# EAGLE design 40khz_ultrasonic_transmitter (EAGLE 6.5.0)
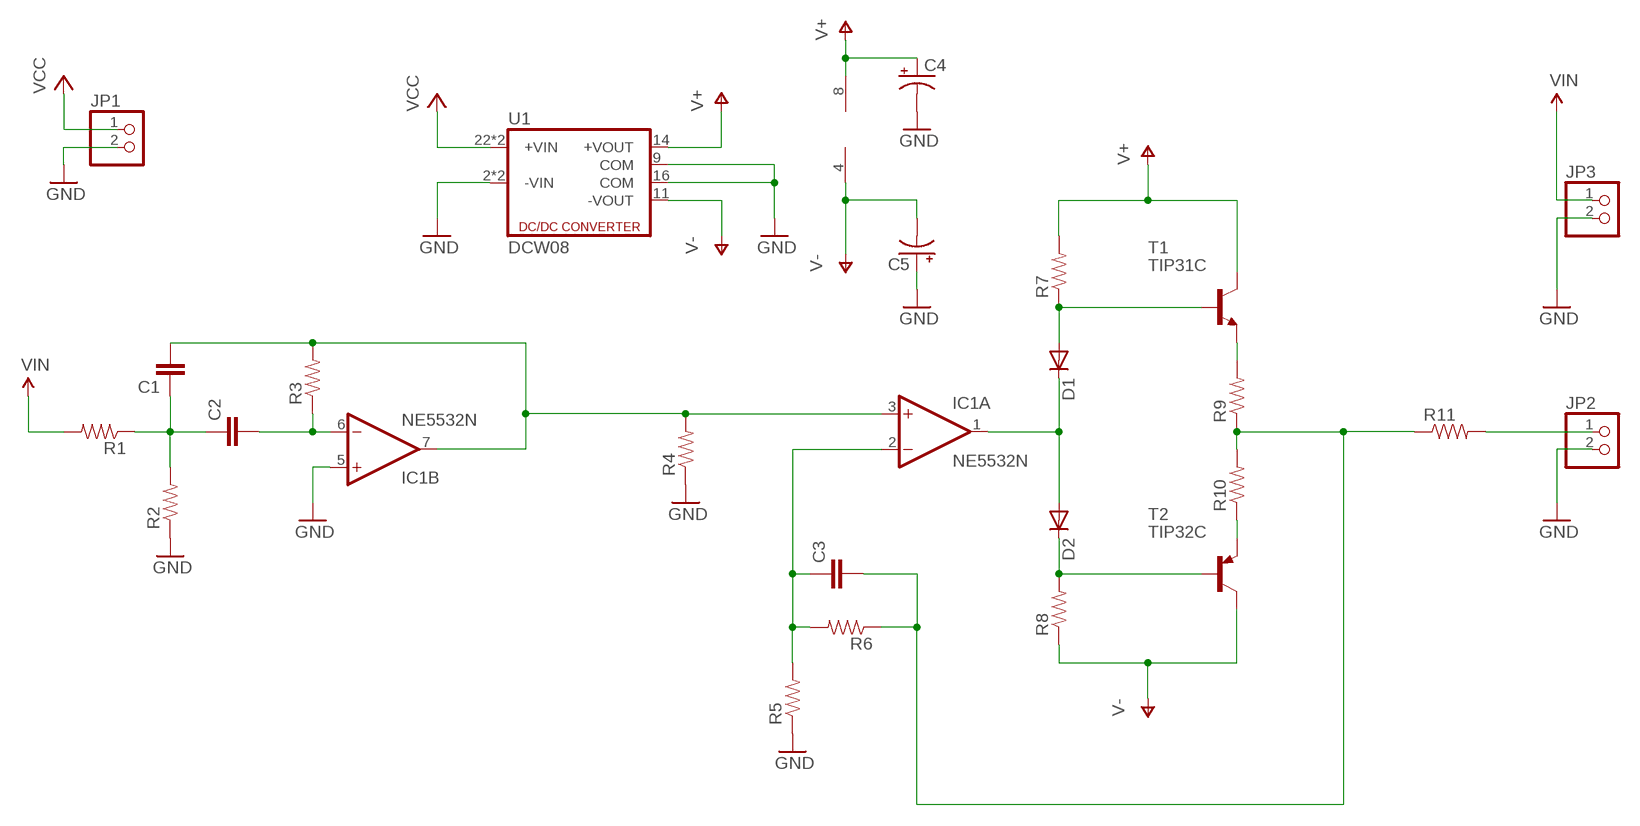
[diagram p0: schematic, sheet 1]

## Parts
C1  CAPPTH2  [CAP-PTH-SMALL2]
C2  CAPPTH2  [CAP-PTH-SMALL2]
C3  CAPPTH2  [CAP-PTH-SMALL2]
C4  CAP_POLPTH1  [CPOL-RADIAL-100UF-25V]
C5  CAP_POLPTH1  [CPOL-RADIAL-100UF-25V]
D1  DIODE1N4148  [DIODE-1N4148]
D2  DIODE1N4148  [DIODE-1N4148]
IC1  NE5532N  [DIL08]
JP1  PINHD-1X2  [1X02]
JP2  PINHD-1X2  [1X02]
JP3  PINHD-1X2  [1X02]
R1  RESISTORPTH-1/4W  [AXIAL-0.4]
R2  RESISTORPTH-1/4W  [AXIAL-0.4]
R3  RESISTORPTH-1/4W  [AXIAL-0.4]
R4  RESISTORPTH-1/4W  [AXIAL-0.4]
R5  RESISTORPTH-1/4W  [AXIAL-0.4]
R6  RESISTORPTH-1/4W  [AXIAL-0.4]
R7  RESISTORPTH-1/4W  [AXIAL-0.4]
R8  RESISTORPTH-1/4W  [AXIAL-0.4]
R9  RESISTORPTH-1/4W  [AXIAL-0.4]
R10  RESISTORPTH-1/4W  [AXIAL-0.4]
R11  RESISTORPTH-2W  [AXIAL-0.8]
T1  TIP31C  [TO220]
T2  TIP32C  [TO220]
U1  DCW08  [DCW08]

## Nets
GND: C4.2(-) C5.1(+) IC1.5(B:+IN) JP1.2 JP2.2 JP3.2 R2.P$1 R4.P$1 R5.P$1 U1.2(-VIN) U1.3(-VIN) U1.9(COM) U1.16(COM)
N$1: C3.2 R6.P$1 R9.P$1 R10.P$2 R11.P$1
N$2: R9.P$2 T1.3(E)
N$3: R10.P$1 T2.3(E)
N$4: D1.A R7.P$1 T1.1(B)
N$5: D2.C R8.P$2 T2.1(B)
N$6: C1.2 IC1.3(A:+IN) IC1.7(B:OUT) R3.P$2 R4.P$2
N$7: C1.1 C2.1 R1.P$1 R2.P$2
N$8: C3.1 IC1.2(A:-IN) R5.P$2 R6.P$2
N$9: C2.2 IC1.6(B:-IN) R3.P$1
N$10: JP2.1 R11.P$2
N$14: D1.C D2.A IC1.1(A:OUT)
V+: C4.1(+) IC1.8(P:V+) R7.P$2 T1.2(C) U1.14(+VOUT)
V-: C5.2(-) IC1.4(P:V-) R8.P$1 T2.2(C) U1.11(-VOUT)
VCC: JP1.1 U1.22(+VIN) U1.23(+VIN)
VIN: JP3.1 R1.P$2

## Library data of the parts
C1-C3 = SparkFun-Passives:CAP: Capacitor Standard 0603 ceramic capacitor, and 0.1" leaded capacitor.
C4 C5 = SparkFun-Passives:CAP_POL: Capacitor Polarized These are standard SMD and PTH capacitors. Normally 10uF, 47uF, and 100uF in electrolytic and tantalum varieties. Always verify the external diameter of the through hole cap, it varies with capacity, voltage, and manufacturer. The EIA devices should be standard.
D1 D2 = SparkFun-DiscreteSemi:DIODE: Diode These are standard reverse protection diodes and small signal diodes. SMA package can handle up to about 1A. SOD-323 can handle about 200mA. What the SOD-323 package when ordering, there are some mfgs out there that are 5-pin packages.
IC1 = linear:NE5532: AUDIO AMPLIFIER
JP1-JP3 = pinhead:PINHD-1X2: PIN HEADER
R1-R11 = SparkFun-Passives:RESISTOR: Resistor Basic schematic elements and footprints for 0603, 1206, and PTH resistors.
T1 = transistor-neu-to92:TIP31C: NPN TRANSISTOR
T2 = transistor:TIP32: PNP Transistor Medium Power Linear Switching Applications Source: http://onsemi.com
U1 = dc-dc-converter:DCW08: DCW08 Isolated DC/DC Converters 8W From: http://www.mouser.com/ds/2/260/DCW08-spec-42779.pdf

## Board
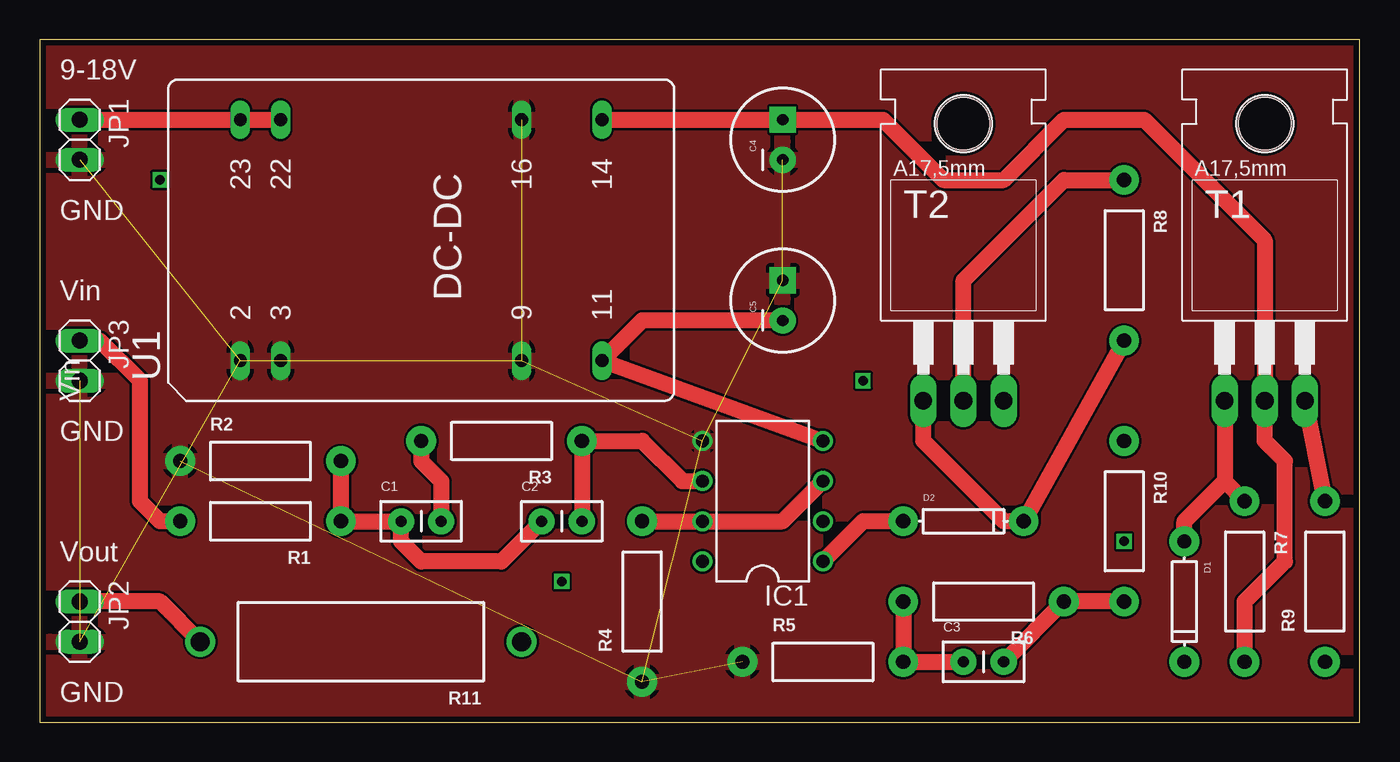
[diagram p1: board, top side]
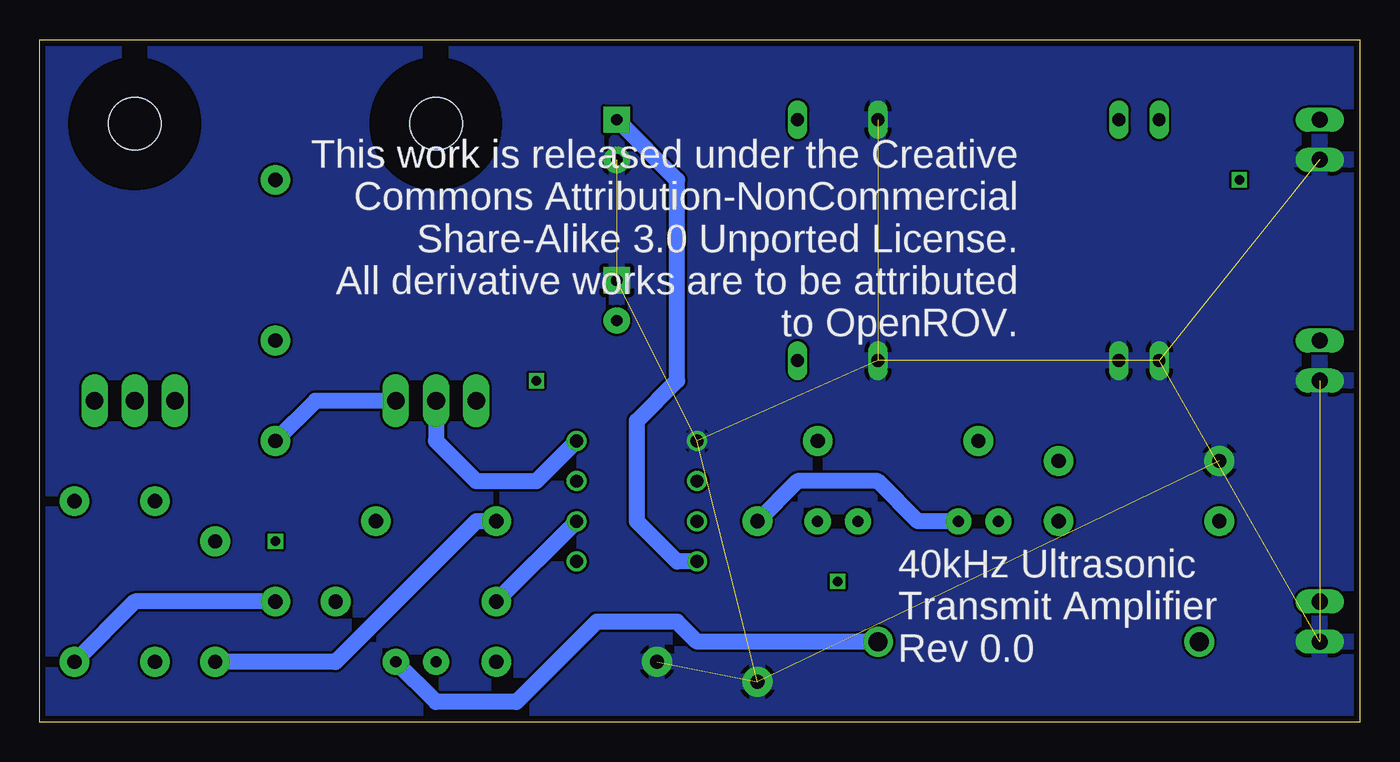
[diagram p2: board, bottom side, seen from below]

Size 83.49 x 43.17 mm. Coordinates in mm from the lower left corner, seen from the top.
Outline: 0,0 83.49,0 83.49,43.17 0,43.17 0,0
Copper layers (1*16): Top 0.0356mm / dielectric 1.5011mm / Bottom 0.0356mm
Design rules "LaenPCBOrder": minimum track width 6mil, minimum drill 13mil, track to track 6mil, track to pad 6mil, pad to pad 6mil, via to via 6mil, smd to smd 6mil, copper to edge 15mil, drill to drill 6mil, minimum pad ring 7mil, minimum via ring 7mil, stop-mask expansion 3mil, vias tented up to drill 0mil, thermal gap 10mil

### Footprints (pad centres in the part's own frame; a part is rotated, then mirrored left to right if it is on the bottom)
CAP-PTH-SMALL2 = drill 0.7 pad 1.651: 1 0,0; 2 2.54,0
CPOL-RADIAL-100UF-25V = drill 0.7 pad 1.651 square: 1 1.27,0 | drill 0.7 pad 1.651: 2 -1.27,0
DIODE-1N4148 = drill 0.9 pad 1.88: A -3.81,0; C 3.81,0
DIL08 = drill 0.813 pad 1.27: 1 -3.81,-3.81; 2 -1.27,-3.81; 3 1.27,-3.81; 4 3.81,-3.81; 5 3.81,3.81; 6 1.27,3.81; 7 -1.27,3.81; 8 -3.81,3.81
1X02 = drill 1.016 long: 1 -1.27,0; 2 1.27,0
AXIAL-0.4 = drill 0.9 pad 1.88: P$1 -5.08,0; P$2 5.08,0
AXIAL-0.8 = drill 1.2 pad 1.88: P$1 -10.16,0; P$2 10.16,0
TO220 = drill 1.118 long: 1 -2.54,-6.35; 2 0,-6.35; 3 2.54,-6.35 | hole 3.302: 0,11.176
DCW08 = drill 0.813 long: 2 -7.62,11.43; 3 -7.62,8.89; 9 -7.62,-6.35; 11 -7.62,-11.43; 14 7.62,-11.43; 16 7.62,-6.35; 22 7.62,8.89; 23 7.62,11.43

### Placement (x,y rotation side)
C1  22.86,12.7 0 top
C2  31.75,12.7 0 top
C3  58.42,3.81 0 top
C4  46.99,36.83 90 top
C5  46.99,26.67 90 top
D1  72.39,7.62 270 top
D2  58.42,12.7 0 top
IC1  45.72,13.97 90 top
JP1  2.54,36.83 270 top
JP2  2.54,6.35 270 top
JP3  2.54,22.86 270 top
R1  13.97,12.7 180 top
R2  13.97,16.51 0 top
R3  29.21,17.78 180 top
R4  38.1,7.62 90 top
R5  49.53,3.81 0 top
R6  59.69,7.62 180 top
R7  76.2,8.89 270 top
R8  68.58,29.21 270 top
R9  81.28,8.89 90 top
R10  68.58,12.7 270 top
R11  20.32,5.08 180 top
T1  77.47,26.67 0 top
T2  58.42,26.67 0 top
U1  24.13,30.48 90 top

### Tracks (layer width: path | path; a pad name or v marks a point on that pad's centre or on a via)
GND  (12 unrouted)
  pour Top: 0,43.18 83.82,43.18 83.82,0 0,0
  pour Bottom: 0,43.18 83.82,43.18 83.82,0 0,0
N$1
  Top 1.016: R10.P$2 R6.P$1 C3.2
  Bottom 1.016: R10.P$2 77.47,7.62 R9.P$1 | R11.P$1 41.91,5.08 43.18,6.35 48.26,6.35 53.34,1.27 58.42,1.27 C3.2
N$2
  Top 1.016: T1.3 R9.P$2
N$3
  Bottom 1.016: T2.3 66.04,20.32 R10.P$1
N$4
  Top 1.016: T1.1 74.93,15.24 | 74.93,15.24 R7.P$1 | D1.A 72.39,12.7 74.93,15.24
N$5
  Top 1.016: R8.P$2 D2.C 60.96,12.7 55.88,17.78 T2.1
N$6
  Top 1.016: R4.P$2 IC1.7 46.99,12.7 IC1.3 | R3.P$2 24.13,16.51 25.4,15.24 C1.2
  Bottom 1.016: C1.2 27.94,12.7 30.48,15.24 35.56,15.24 R4.P$2
N$7
  Top 1.016: R2.P$2 R1.P$1 C1.1 22.86,11.43 24.13,10.16 29.21,10.16 C2.1
N$8
  Top 1.016: R6.P$2 R5.P$2 C3.1
  Bottom 1.016: R6.P$2 IC1.2
N$9
  Top 1.016: C2.2 R3.P$1 38.1,17.78 40.64,15.24 IC1.6
N$10
  Top 1.016: R11.P$2 7.62,7.62 JP2.1
N$11  (via drill 0.6)
  other vias: 52.07,21.59
N$12  (via drill 0.6)
  other vias: 68.58,11.43
N$13  (via drill 0.6)
  other vias: 33.02,8.89
N$14
  Top 1.016: D2.A 52.07,12.7 IC1.1
  Bottom 1.016: D2.A 55.88,12.7 64.77,3.81 D1.C
N$16  (via drill 0.6)
  other vias: 7.62,34.29
V+
  Top 1.016: U1.14 C4.1 53.34,38.1 57.15,34.29 60.96,34.29 64.77,38.1 69.85,38.1 77.47,30.48 T1.2 77.47,17.78 78.74,16.51 78.74,10.16 76.2,7.62 R7.P$2
  Bottom 1.016: IC1.8 43.18,10.16 45.72,12.7 45.72,19.05 43.18,21.59 43.18,34.29 C4.1
V-
  Top 1.016: IC1.4 U1.11 38.1,25.4 C5.2 | T2.2 58.42,27.94 64.77,34.29 R8.P$1
  Bottom 1.016: T2.2 58.42,17.78 55.88,15.24 52.07,15.24 IC1.4
VCC
  Top 1.016: JP1.1 U1.23 U1.22
VIN
  Top 1.016: R1.P$2 7.62,12.7 6.35,13.97 6.35,21.59 3.81,24.13 JP3.1

### Text on the board
tPlace: 9-18V | GND | Vin | Vin | GND | Vout | GND
bPlace: This work is released under the Creative / Commons Attribution-NonCommercial / Share-Alike 3.0 Unported License. / All derivative works are to be attributed / to OpenROV. | 40kHz Ultrasonic / Transmit Amplifier / Rev 0.0